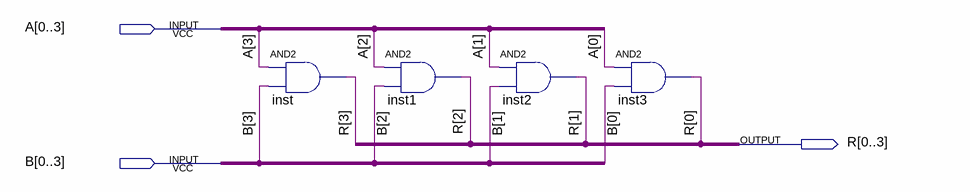
[diagram p0: schematic sheet]
// Quartus schematic ANDs.bdf as structural Verilog: 4 symbols, 3 pins
module ANDs (
  input  [0:3] A,
  input  [0:3] B,
  output [0:3] R
);

  and inst (R[3], A[3], B[3]);
  and inst1 (R[2], A[2], B[2]);
  and inst2 (R[1], A[1], B[1]);
  and inst3 (R[0], A[0], B[0]);
endmodule
